# EAGLE design 10x2-Epaper-Breakout-Board-v10 (EAGLE 5.04)
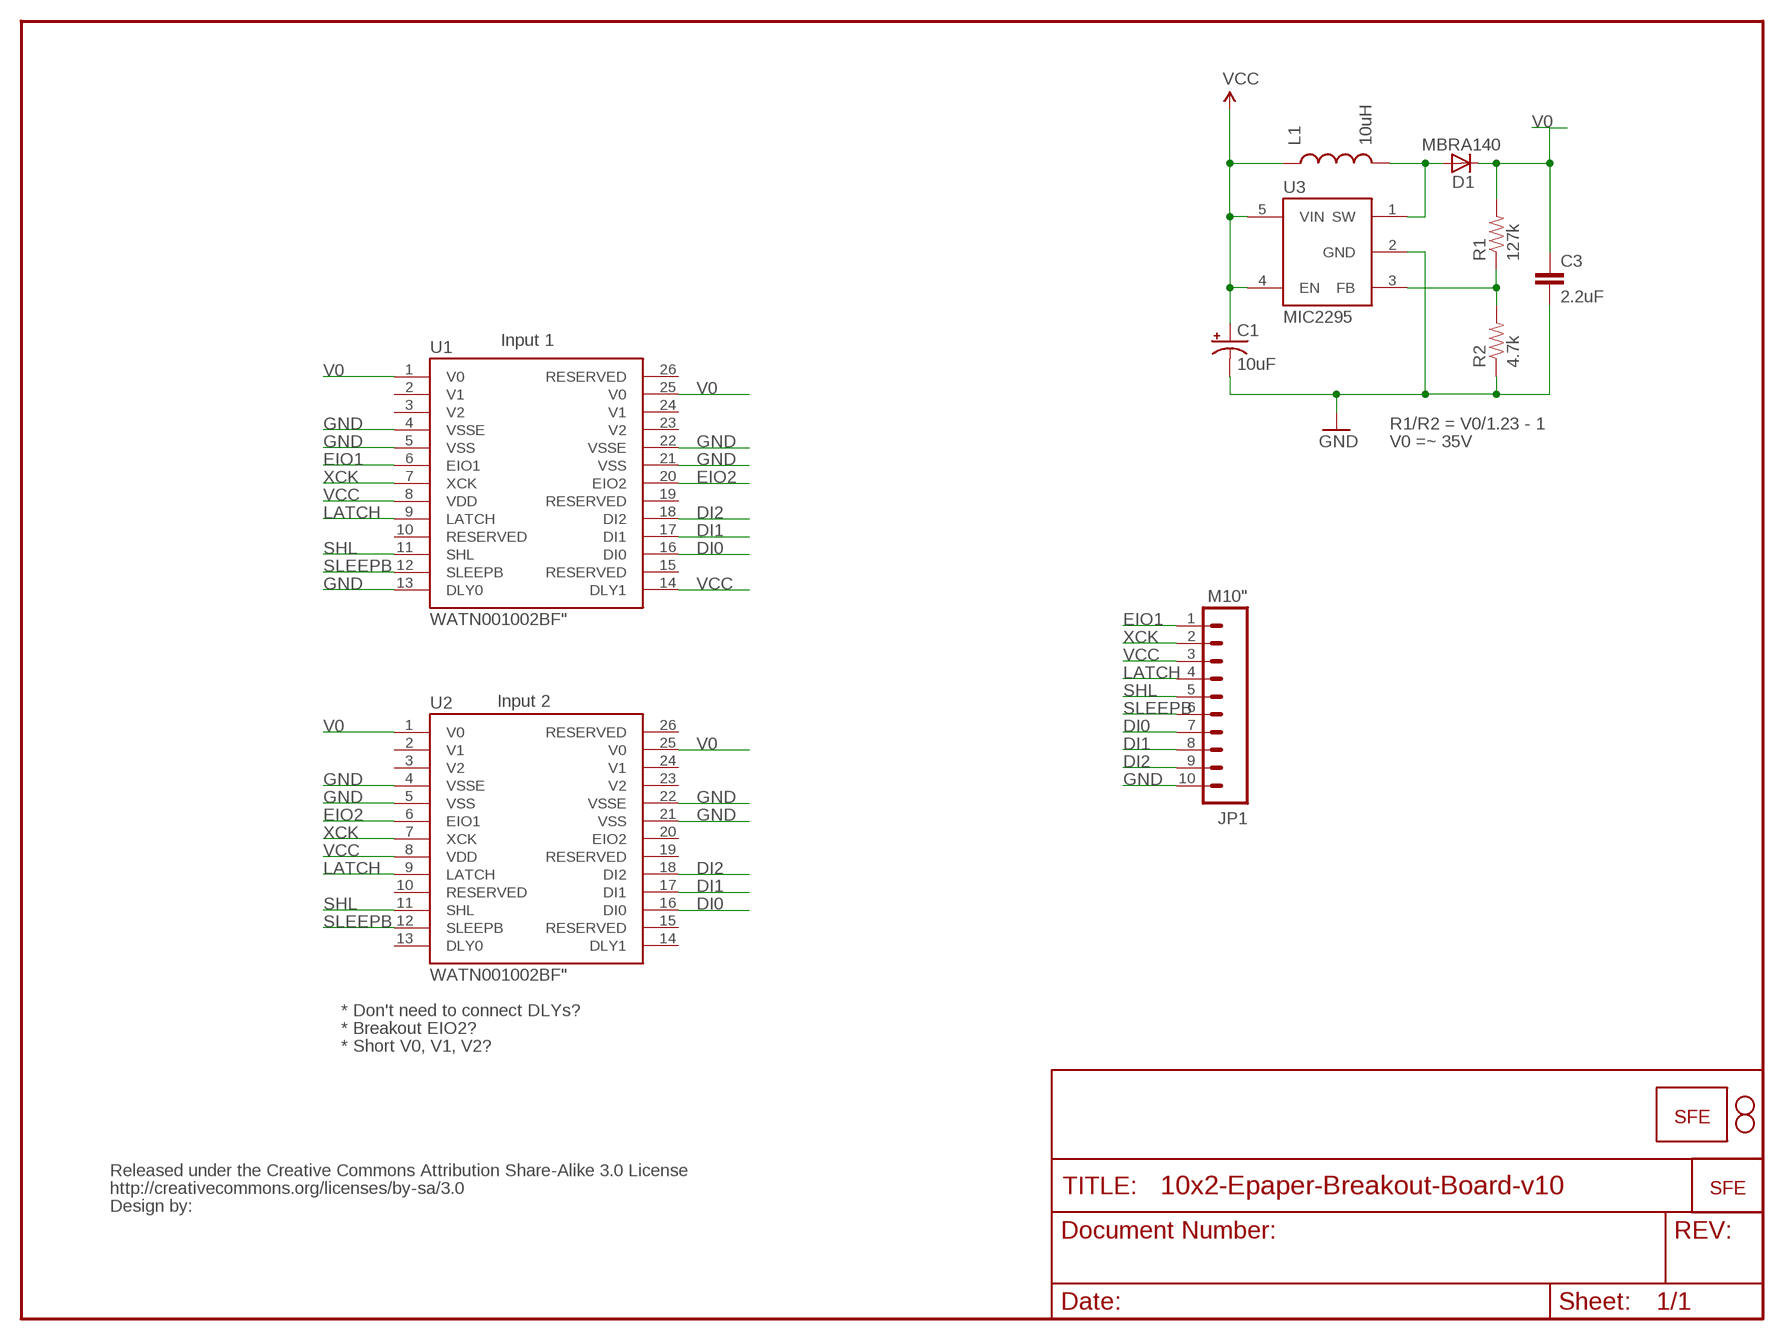
[diagram p0: schematic, sheet 1]

## Parts
C1  10uF  CAP_POL1206  [EIA3216]
C3  2.2uF  CAP1206  [1206]
D1  MBRA140  DIODESMA  [SMA-DIODE]
JP1  M10"  [1X10]
JP2  STAND-OFF  [STAND-OFF]
JP5  STAND-OFF  [STAND-OFF]
JP6  LOGO-SFENEW  [SFE-NEW-WEBLOGO]
JP7  LOGO-SFESK  [SFE-LOGO-FLAME]
L1  10uH  INDUCTOR1210  [1210]
R1  127k  RESISTOR0402-RES  [0402-RES]
R2  4.7k  RESISTOR0402-RES  [0402-RES]
U1  WATN001002BF"  [FFC26]
U2  WATN001002BF"  [FFC26]
U3  MIC2295  V_REG_TPS61040SMD  [SOT23-5]
U$1  CREATIVE_COMMONS  [CREATIVE_COMMONS]

## Nets
DI0: JP1.7 U1.16(DI0) U2.16(DI0)
DI1: JP1.8 U1.17(DI1) U2.17(DI1)
DI2: JP1.9 U1.18(DI2) U2.18(DI2)
EIO1: JP1.1 U1.6(EIO1)
EIO2: U1.20(EIO2) U2.6(EIO1)
GND: C1.C(-) C3.2 JP1.10 R2.1 U1.4(VSSE) U1.5(VSS) U1.13(DLY0) U1.21(VSS) U1.22(VSSE) U2.4(VSSE) U2.5(VSS) U2.21(VSS) U2.22(VSSE) U3.2(GND)
LATCH: JP1.4 U1.9(LATCH) U2.9(LATCH)
SHL: JP1.5 U1.11(SHL) U2.11(SHL)
SLEEPB: JP1.6 U1.12(SLEEPB) U2.12(SLEEPB)
V0: C3.1 D1.C R1.2 U1.1(V0) U1.25(V0) U2.1(V0) U2.25(V0)
VCC: C1.A(+) JP1.3 L1.1 U1.8(VDD) U1.14(DLY1) U2.8(VDD) U3.4(EN) U3.5(VIN)
VR_LCD_FB: R1.1 R2.2 U3.3(FB)
VR_LCD_SW: D1.A L1.2 U3.1(SW)
XCK: JP1.2 U1.7(XCK) U2.7(XCK)
Unconnected: U1.2(V1) U1.3(V2) U1.10(RESERVED) U1.15(RESERVED) U1.19(RESERVED) U1.23(V2) U1.24(V1) U1.26(RESERVED) U2.2(V1) U2.3(V2) U2.10(RESERVED) U2.13(DLY0) U2.14(DLY1) U2.15(RESERVED) U2.19(RESERVED) U2.20(EIO2) U2.23(V2) U2.24(V1) U2.26(RESERVED)

## Notes on the sheet
- Input 1
- R1/R2 = V0/1.23 - 1
- V0 =~ 35V
- Input 2
- * Don't need to connect DLYs?
- * Breakout EIO2?
- * Short V0, V1, V2?

## Library data of the parts
C1 = SparkFun:CAP_POL: Capacitor Polarized These are standard SMD and PTH capacitors. Normally 10uF, 47uF, and 100uF in electrolytic and tantalum varieties. Always verify the external diameter of the through hole cap, it varies with capacity, voltage, and manufacturer. The EIA devices should be standard.
C3 = SparkFun:CAP: Capacitor Standard 0603 ceramic capacitor, and 0.1" leaded capacitor.
D1 = SparkFun:DIODE: Diode These are standard reverse protection diodes and small signal diodes. SMA package can handle up to about 1A. SOD-323 can handle about 200mA. What the SOD-323 package when ordering, there are some mfgs out there that are 5-pin packages.
JP1 = SparkFun:M10: Header 10 Standard 10-pin 0.1" header. Use with straight break away headers (SKU : PRT-00116), right angle break away headers (PRT-00553), swiss pins (PRT-00743), machine pins (PRT-00117), and female headers (PRT-00115).
JP2 JP5 = SparkFun:STAND-OFF: Stand Off This is the mechanical footprint for a #4 phillips button head screw. Use the keepout ring to avoid running the screw head into surrounding components. SKU : PRT-00447
JP6 JP7 = SparkFun:LOGO-SFE: Spark Fun Electronics PCB Logo This is the standard Spark Fun Electronics PCB logo.
L1 = SparkFun:INDUCTOR: Inductors Basic Inductor/Choke - 0603 and 1206. Footprints are not proven and vary greatly between part numbers.
R1 R2 = SparkFun:RESISTOR: Resistor Basic schematic elements and footprints for 0603, 1206, and PTH resistors.
U1 U2 = SparkFun:WATN001002BF: 10x1 and 10x2 16-segment E-paper Display ***Unproven!!!***
U3 = SparkFun:V_REG_TPS61040
U$1 = SparkFun:CREATIVE_COMMONS

## Board
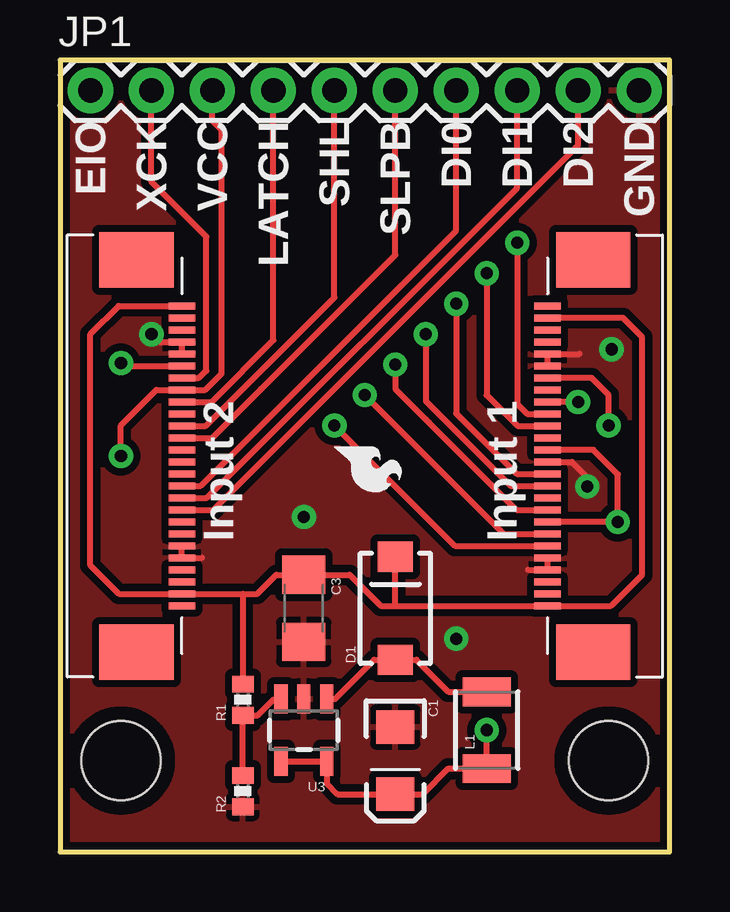
[diagram p1: board, top side]
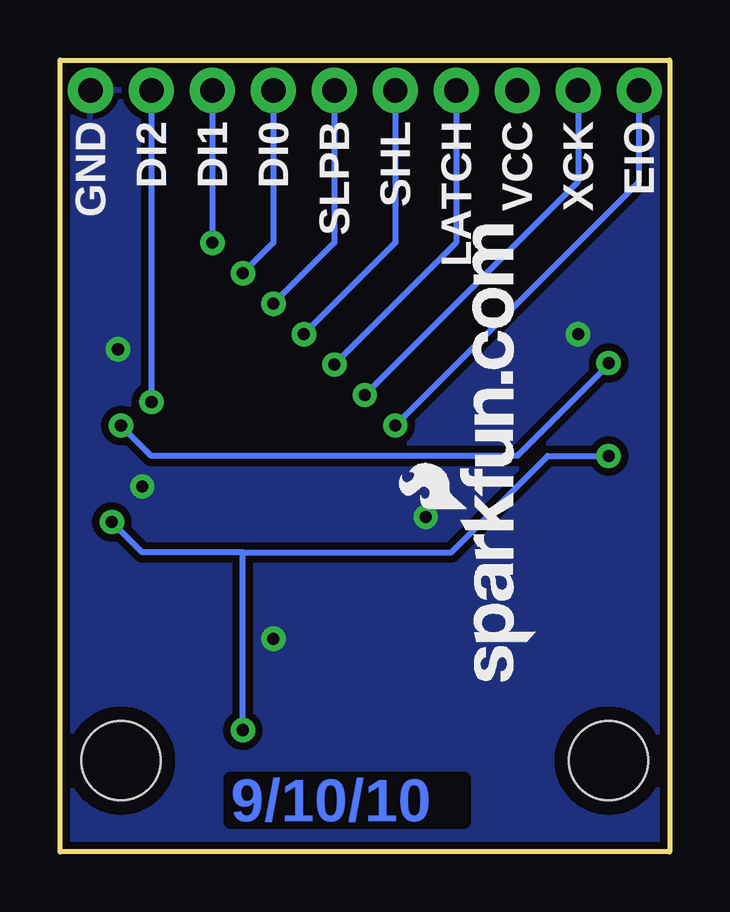
[diagram p2: board, bottom side, seen from below]

Size 25.4 x 33.02 mm. Coordinates in mm from the lower left corner, seen from the top.
Outline: 0,0 25.4,0 25.4,33.02 0,33.02 0,0
Copper layers (1*16): Top 0.035mm / dielectric 1.5mm / Bottom 0.035mm
Design rules "SparkFun": minimum track width 8mil, minimum drill 20mil, track to track 8mil, track to pad 8mil, pad to pad 8mil, via to via 8mil, smd to smd 8mil, copper to edge 8mil, drill to drill 8mil, minimum pad ring 12mil, minimum via ring 10mil, stop-mask expansion 4mil, vias tented up to drill 20mil, thermal gap 10mil

### Footprints (pad centres in the part's own frame; a part is rotated, then mirrored left to right if it is on the bottom)
EIA3216 = smd 1.4 x 1.6: A 1.4,0; C -1.4,0
1206 = smd 1.6 x 1.8: 1 -1.4,0; 2 1.4,0
SMA-DIODE = smd 1.27 x 1.47: A -2.15,0; C 2.15,0
1X10 = drill 1.016 pad 1.88 round: 1 0,0; 2 2.54,0; 3 5.08,0; 4 7.62,0; 5 10.16,0; 6 12.7,0; 7 15.24,0; 8 17.78,0; 9 20.32,0; 10 22.86,0
STAND-OFF = hole 3.302: 0,0
1210 = smd 1.2 x 2: 1 -1.6,0; 2 1.6,0
0402-RES = smd 0.7 x 0.9: 1 -0.65,0; 2 0.65,0
FFC26 = smd 0.28 x 1.1: 1 6.25,0; 2 5.75,0; 3 5.25,0; 4 4.75,0; 5 4.25,0; 6 3.75,0; 7 3.25,0; 8 2.75,0; 9 2.25,0; 10 1.75,0; 11 1.25,0; 12 0.75,0; 13 0.25,0; 14 -0.25,0; 15 -0.75,0; 16 -1.25,0; 17 -1.75,0; 18 -2.25,0; 19 -2.75,0; 20 -3.25,0; 21 -3.75,0; 22 -4.25,0; 23 -4.75,0; 24 -5.25,0; 25 -5.75,0; 26 -6.25,0 | smd 2.3 x 3.1: P$1 8.18,1.9; P$3 -8.18,1.9
SOT23-5 = smd 0.55 x 1.2: 1 -0.95,-1.3; 2 0,-1.3; 3 0.95,-1.3; 4 0.95,1.3; 5 -0.95,1.3

### Placement (x,y rotation side)
C1  13.97,3.81 270 top
C3  10.16,10.16 270 top
D1  13.97,10.16 90 top
JP1  1.27,31.75 0 top
JP2  2.54,3.81 0 top
JP5  22.86,3.81 0 top
JP6  5.59,7.11 90 bottom
JP7  11.43,16.89 270 top
L1  17.78,5.08 90 top
R1  7.62,6.35 90 top
R2  7.62,2.54 90 top
U1  20.32,16.51 270 top
U2  5.08,16.51 90 top
U3  10.16,5.08 180 top
U$1  38.1,-19.05 90 top  (outside the outline)

### Tracks (layer width: path | path; a pad name or v marks a point on that pad's centre or on a via)
DI0  (via drill 0.51)
  Top 0.254: U1.16 19.07,17.76 17.78,19.05 v17.78,24.13 | U2.16 5.86,15.26 8.89,18.29 16.51,25.91 JP1.7
  Bottom 0.254: v17.78,24.13 16.51,25.4 JP1.7
DI1  (via drill 0.51)
  Top 0.254: U1.17 19.46,18.26 19.05,18.67 v19.05,25.4 | U2.17 6.12,14.76 19.05,27.69 JP1.8
  Bottom 0.254: JP1.8 v19.05,25.4
DI2  (via drill 0.51)
  Top 0.254: v21.59,18.76 U1.18 | U2.18 6.39,14.26 21.59,29.46 JP1.9
  Bottom 0.254: JP1.9 v21.59,18.76
EIO1  (via drill 0.51)
  Top 0.254: U1.6 16.45,12.76 v11.43,17.78
  Bottom 0.254: v11.43,17.78 1.27,27.94 JP1.1
EIO2  (via drill 0.51)
  Top 0.254: U2.6 2.67,20.26 v2.54,20.39 | U1.20 22.15,19.76 22.86,19.05 v22.86,17.78
  Bottom 0.254: v2.54,20.39 2.54,20.32 6.35,16.51 21.59,16.51 v22.86,17.78
GND  (via drill 0.51)
  Top 0.254: U1.5 U1.4 19.51,11.76 | U1.21 U1.22 21.65,20.76 | U2.21 U2.22 5.91,12.26 | U2.5 U2.4 4.14,21.26 v3.81,21.59 | U1.13 21.33,16.26 21.97,15.62 v21.97,15.24
  other vias: 10.16,13.97 16.51,8.89 22.99,20.95
  pour Top (isolate 0.305): 0,33.02 0,0 25.4,0 25.4,33.02
  pour Bottom (isolate 0.305): 0,33.02 0,0 25.4,0 25.4,33.02
LATCH  (via drill 0.51)
  Top 0.254: 4.79,18.76 U2.9 6.31,18.76 8.89,21.34 JP1.4 | U1.9 19.01,14.26 15.37,17.91 | 15.37,17.91 15.24,18.03 | v13.97,20.32 13.97,19.3 15.37,17.91
  Bottom 0.254: v13.97,20.32 8.89,25.4 JP1.4
SHL  (via drill 0.51)
  Top 0.254: U1.11 18.78,15.26 15.24,18.8 v15.24,21.59 | U2.11 6.08,17.76 11.43,23.11 JP1.5
  Bottom 0.254: v15.24,21.59 11.43,25.4 JP1.5
SLEEPB  (via drill 0.51)
  Top 0.254: U1.12 19.04,15.76 16.51,18.29 v16.51,22.86 | U2.12 6.34,17.26 8.38,19.3 13.97,24.89 JP1.6
  Bottom 0.254: v16.51,22.86 13.97,25.4 JP1.6
V0
  Top 0.254: 7.62,10.76 U2.25 2.45,10.76 1.27,11.94 1.27,21.59 2.44,22.76 U2.1 | 7.62,10.76 8.22,10.76 9.02,11.56 C3.1 12.06,11.56 13.36,10.26 13.97,10.26 | 7.62,10.76 R1.2 | 13.97,10.26 U1.1 22.96,10.26 24.26,11.56 24.26,21.46 23.46,22.26 U1.25 | 13.97,10.26 D1.C
VCC  (via drill 0.51)
  Top 0.254: U1.14 22.23,16.76 23.24,15.75 v23.24,13.76 U1.8 | v2.54,16.51 2.54,17.78 4.02,19.26 U2.8 6.05,19.26 6.73,19.94 6.73,30.1 6.35,30.48 JP1.3 | v17.78,5.08 L1.1 16.18,3.48 15.11,2.41 C1.A 11.56,2.41 11.11,2.86 U3.5 U3.4
  Bottom 0.254: v2.54,16.51 5.08,16.51 9.1,12.49 17.78,12.49 | v17.78,5.08 17.78,12.49 | 17.78,12.49 21.97,12.49 v23.24,13.76
VR_LCD_FB
  Top 0.254: U3.3 9.18,6.35 8.89,6.35 8.24,5.7 R1.1 R2.2
VR_LCD_SW
  Top 0.254: L1.2 16.18,6.68 14.85,8.01 D1.A 13.09,8.01 11.46,6.38 U3.1
XCK  (via drill 0.51)
  Top 0.254: U2.7 5.79,19.76 6.1,20.07 6.1,25.65 3.81,27.94 JP1.2 | U1.7 18.49,13.26 v12.7,19.05
  Bottom 0.254: v12.7,19.05 3.81,27.94 JP1.2

### Text on the board
Bottom: 9/10/10
tPlace: EIO | XCK | VCC | LATCH | SHL | SLPB | DI0 | DI1 | DI2 | GND | Input 2 | Input 1
bPlace: EIO | XCK | VCC | LATCH | SHL | SLPB | DI0 | DI1 | DI2 | GND